# EAGLE schematic powersupply (EAGLE 6.5.0)
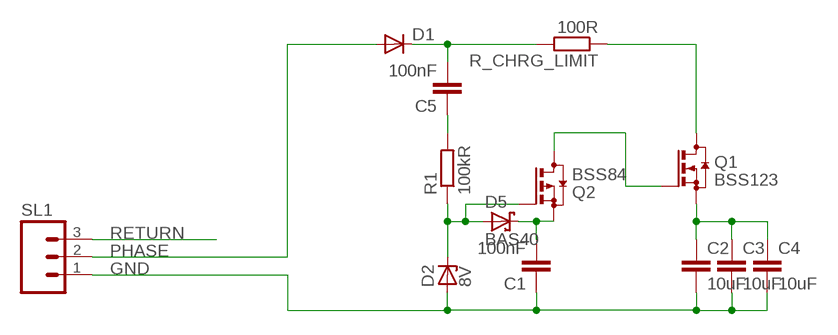
[diagram p0: schematic, sheet 1]

## Parts
C1  100nF  C-EUC0603  [C0603]
C2  10uF  C-EUC0805  [C0805]
C3  10uF  C-EUC0805  [C0805]
C4  10uF  C-EUC0805  [C0805]
C5  100nF  C-EUC0603  [C0603]
D1  DIODE-DO214AA  [DO214AA]
D2  8V  ZENER-DIODESOD80C  [SOD80C]
D5  BAS40  [SOT23]
Q1  BSS123  [SOT23]
Q2  BSS84  [SOT23]
R1  100kR  R-EU_R0603  [R0603]
R_CHRG_LIMIT  100R  R-EU_R0603  [R0603]
SL1  M03  [03P]

## Nets
GND: C1.1 C2.2 C3.2 C4.2 D2.A SL1.1
N$1: C1.2 D5.3(C) Q2.2(S)
N$2: C5.1 R1.2
N$3: C5.2 D1.C R_CHRG_LIMIT.2
N$4: Q1.1(G) Q2.3(D)
PHASE: D1.A SL1.2
RETURN: SL1.3
U_NON_REG: C2.1 C3.1 C4.1 Q1.2(S)
U_POSITIVE: Q1.3(D) R_CHRG_LIMIT.1
U_TRIG: D2.C D5.1(A) Q2.1(G) R1.1

## Library data of the parts
C1-C5 = resistor:C-EU: CAPACITOR, European symbol
D1 = diode:DIODE-: DIODE
D2 = diode:ZENER-DIODE: Z-Diode
D5 = diode:BAS40: Silicon Schottky Diodes General-purpose diode for high-speed switching
Q1 = transistor-small-signal:BSS123: N-CHANNEL MOS FET
Q2 = transistor-small-signal:BSS84: P-CHANNEL MOS FET
R1 R_CHRG_LIMIT = resistor:R-EU_: RESISTOR, European symbol
SL1 = con-amp-quick:M03: AMP QUICK CONNECTOR; OC_FARNELL: unknown; OC_NEWARK: unknown